# EAGLE design I2S Mic with 0805 resistors (EAGLE 9.3.0)
COMPANY: ADAFRUIT INDUSTRIES; DRAWN: KTOWN; REV: A
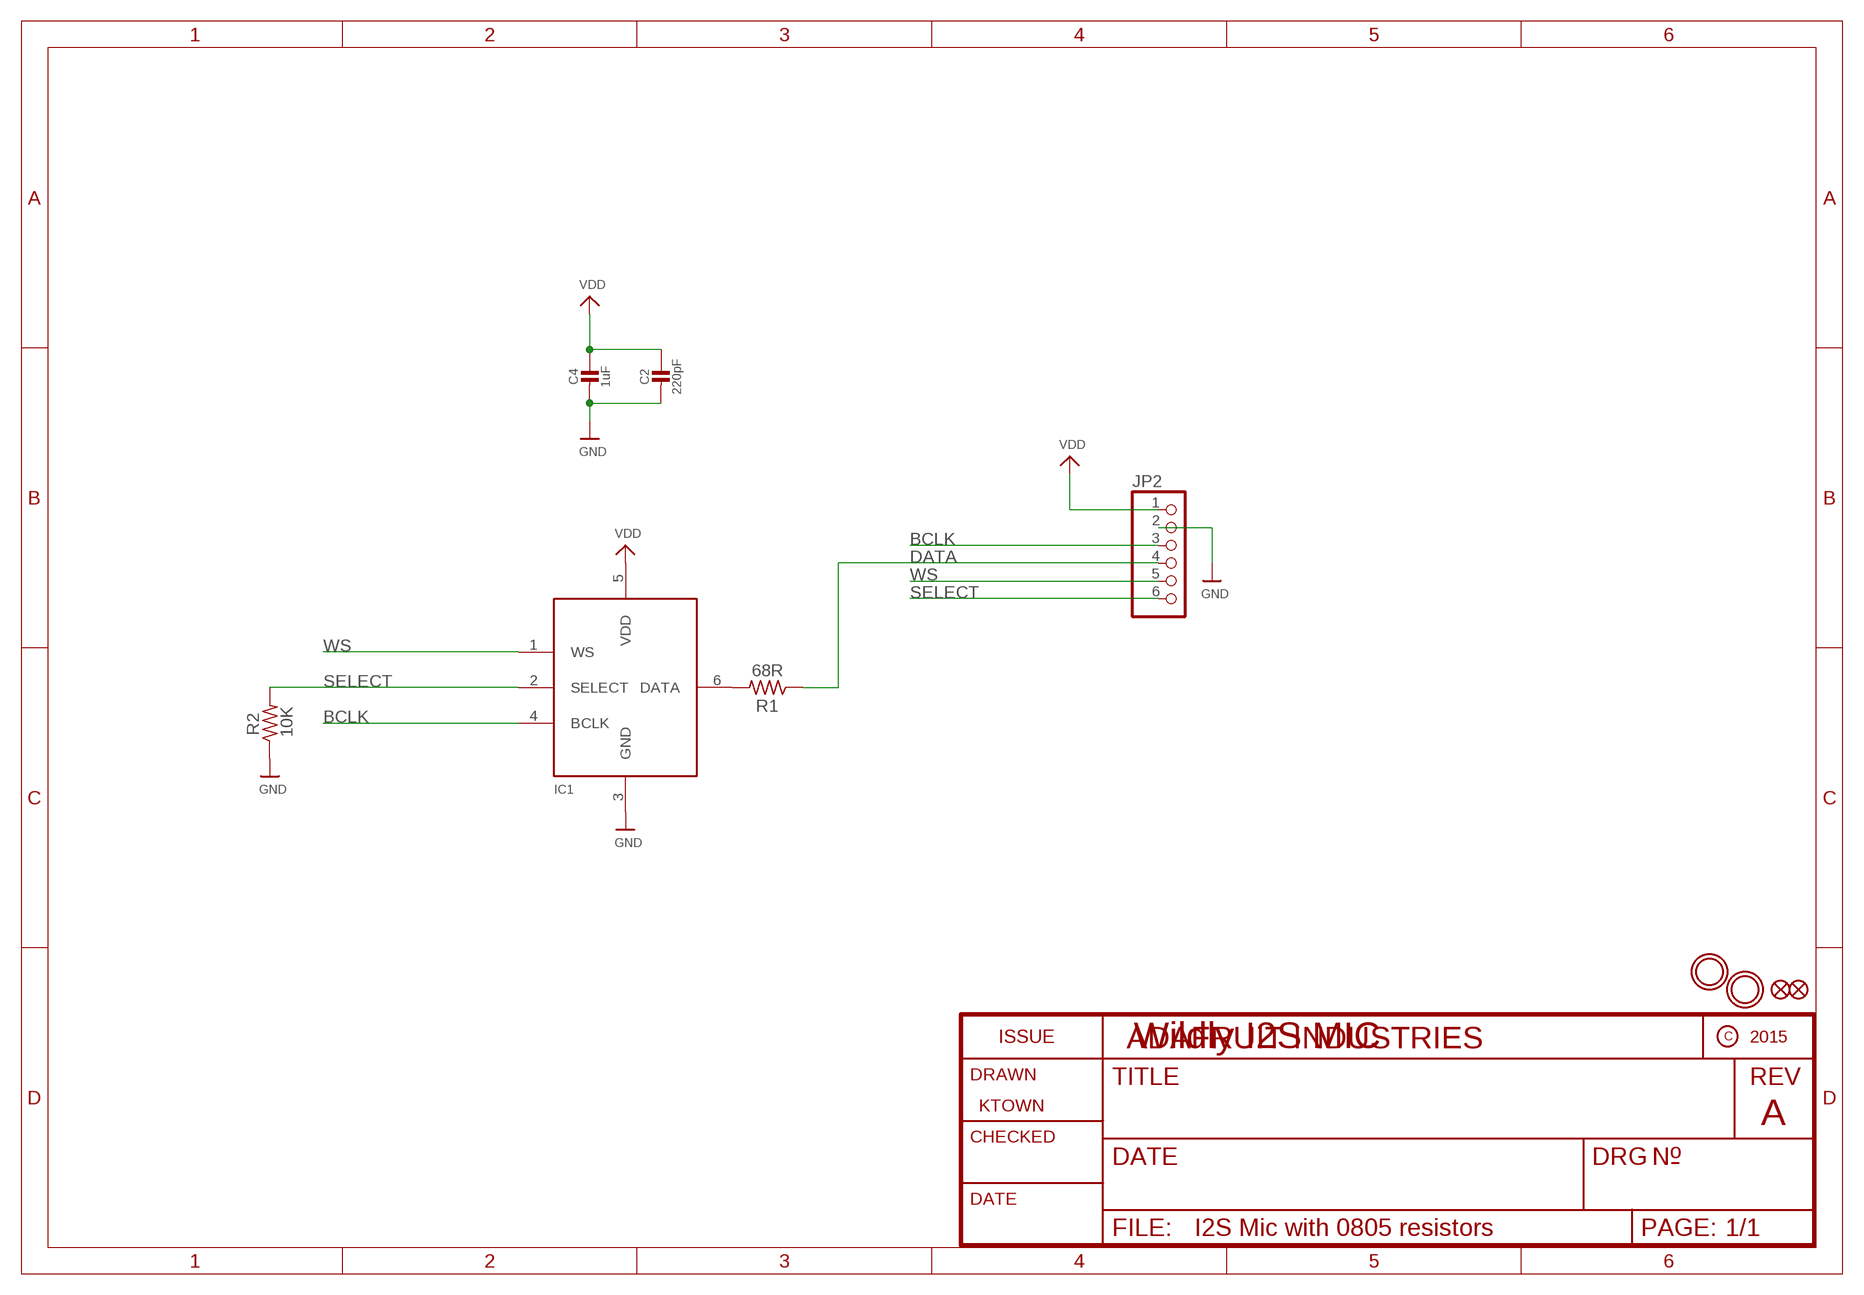
[diagram p0: schematic, sheet 1]

## Parts
C2  220pF  CAP_CERAMIC0805-NOOUTLINE  [0805-NO]
C4  1uF  CAP_CERAMIC0805-NOOUTLINE  [0805-NO]
FID1  FIDUCIAL_1MM  [FIDUCIAL_1MM]
FID2  FIDUCIAL_1MM  [FIDUCIAL_1MM]
IC1  MIC_I2S_SPH0645  [SPH0645LM4H]
JP2  HEADER-1X6ROUND  [1X06_ROUND]
R1  68R  R-US_R0805  [R0805]
R2  10K  R-US_R0805  [R0805]
U$6  MOUNTINGHOLE2.5  [MOUNTINGHOLE_2.5_PLATED]
U$12  MOUNTINGHOLE2.5  [MOUNTINGHOLE_2.5_PLATED]

## Nets
BCLK: IC1.4(BCLK) JP2.3
DATA: JP2.4 R1.1
GND: C2.2 C4.2 IC1.3(GND) JP2.2 R2.1
N$1: IC1.6(DATA) R1.2
SELECT: IC1.2(SELECT) JP2.6 R2.2
VDD: C2.1 C4.1 IC1.5(VDD) JP2.1
WS: IC1.1(WS) JP2.5

## Notes on the sheet
- Wildly I2S MIC

## Library data of the parts
C2 C4 = microbuilder:CAP_CERAMIC: Ceramic Capacitors For new designs, use the packages preceded by an '_' character since they are more reliable: The following footprints should be used on most boards: _0402 - Standard footprint for regular board layouts _0603 - Standard footprint for regular board layouts _0805 - Standard footprint for regular board layouts _1206 - Standard footprint for regular board layouts For extremely tight-pitch boards where space is at a premium, the following 'micro-pitch' footprints can be used (smaller pads, no silkscreen outline, etc.): _0402MP - Micro-pitch footprint for very dense/compact boards _0603MP - Micro-pitch footprint for very dense/compact boards _0805MP - Micro-pitch footprint for very dense/compact boards _1206MP - Micro-pitch footprint for very dense/compact boards
FID1 FID2 = microbuilder:FIDUCIAL: Fiducial Alignment Points Various fiducial points for machine vision alignment.; BOM: EXCLUDE
IC1 = microbuilder:MIC_I2S
JP2 = microbuilder:HEADER-1X6: PIN HEADER
R1 R2 = rcl:R-US_: RESISTOR, American symbol; SPICEPREFIX: R
U$6 U$12 = microbuilder:MOUNTINGHOLE: Mounting Hole For #2 screws (0.086"/2.18mm width, 0.094"/2.4mm hole) use 2.5mm; BOM: EXCLUDE

## Board
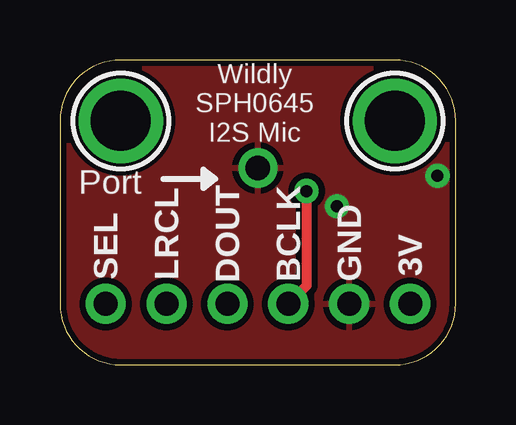
[diagram p1: board, top side]
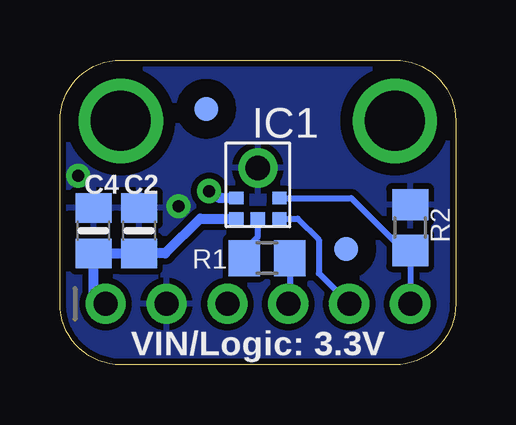
[diagram p2: board, bottom side, seen from below]

Size 16.51 x 12.7 mm. Coordinates in mm from the lower left corner, seen from the top.
Outline: 0,10.16 0,2.54 arc90 2.54,0 13.97,0 arc90 16.51,2.54 16.51,10.16 arc90 13.97,12.7 2.54,12.7 arc90 0,10.16
Copper layers (1*16): Top 0.035mm / dielectric 1.5mm / Bottom 0.035mm
Design rules "SparkFun": minimum track width 8mil, minimum drill 20mil, track to track 8mil, track to pad 8mil, pad to pad 8mil, via to via 8mil, smd to smd 8mil, copper to edge 8mil, drill to drill 8mil, minimum pad ring 12mil, minimum via ring 10mil, stop-mask expansion 4mil, vias tented up to drill 20mil, thermal gap 10mil

### Footprints (pad centres in the part's own frame; a part is rotated, then mirrored left to right if it is on the bottom)
0805-NO = smd 1.24 x 1.5: 1 -0.95,0; 2 0.95,0
FIDUCIAL_1MM = smd 1 x 1: 1 0,0
SPH0645LM4H = smd 0.6 x 0.525: 1 -0.9,1.4; 2 -0.9,0.55; 4 0.9,0.55; 5 0.9,1.4; 6 0,1.4 | drill 1.025 pad 1.625: 3 0,-0.71
1X06_ROUND = drill 1 pad 1.676: 1 -6.35,0; 2 -3.81,0; 3 -1.27,0; 4 1.27,0; 5 3.81,0; 6 6.35,0
R0805 = smd 1.3 x 1.5: 1 -0.95,0; 2 0.95,0
MOUNTINGHOLE_2.5_PLATED = drill 2.5 pad 3.2: P$1 0,0

### Placement (x,y rotation side)
C2  13.21,5.59 90 bottom
C4  15.11,5.59 90 bottom
FID1  10.41,10.67 0 bottom
FID2  4.57,4.83 0 bottom
IC1  8.26,7.49 180 bottom
JP2  8.26,2.54 0 bottom
R1  7.87,4.45 180 bottom
R2  1.9,5.71 270 bottom
U$6  2.54,10.16 0 top
U$12  13.97,10.16 0 top

### Tracks (layer width: path | path; a pad name or v marks a point on that pad's centre or on a via)
BCLK  (via drill 0.5)
  Top 0.406: v10.29,7.24 10.29,3.3 JP2.3
  Bottom 0.406: IC1.4 9.86,6.94 10.16,7.24 v10.29,7.24
DATA
  Bottom 0.254: R1.1 6.92,2.6 JP2.4
GND  (via drill 0.5)
  other vias: 15.75,7.87 11.56,6.6
  pour Bottom (isolate 0.254): 0,0 16.51,0 16.51,12.7 0,12.7
  pour Top (isolate 0.254): 0,0 16.51,0 16.51,12.7 0,12.7
N$1
  Bottom 0.254: R1.2 8.82,4.76 8.26,5.33 IC1.6
SELECT
  Bottom 0.254: IC1.2 4.36,6.94 2.19,4.76 R2.2 JP2.6
VDD
  Bottom 0.406: JP2.1 15.11,3.05 C4.1 C2.1 12.12,4.64 10.66,6.09 IC1.5
WS
  Bottom 0.254: IC1.1 6.6,6.09 5.71,5.21 5.71,3.81 JP2.5

### Text on the board
tPlace: Wildly / SPH0645 / I2S Mic | Port | SEL | LRCL | DOUT | BCLK | GND | 3V
bPlace: VIN/Logic: 3.3V